# Altium schematic sheet Supply.SchDoc
size A4
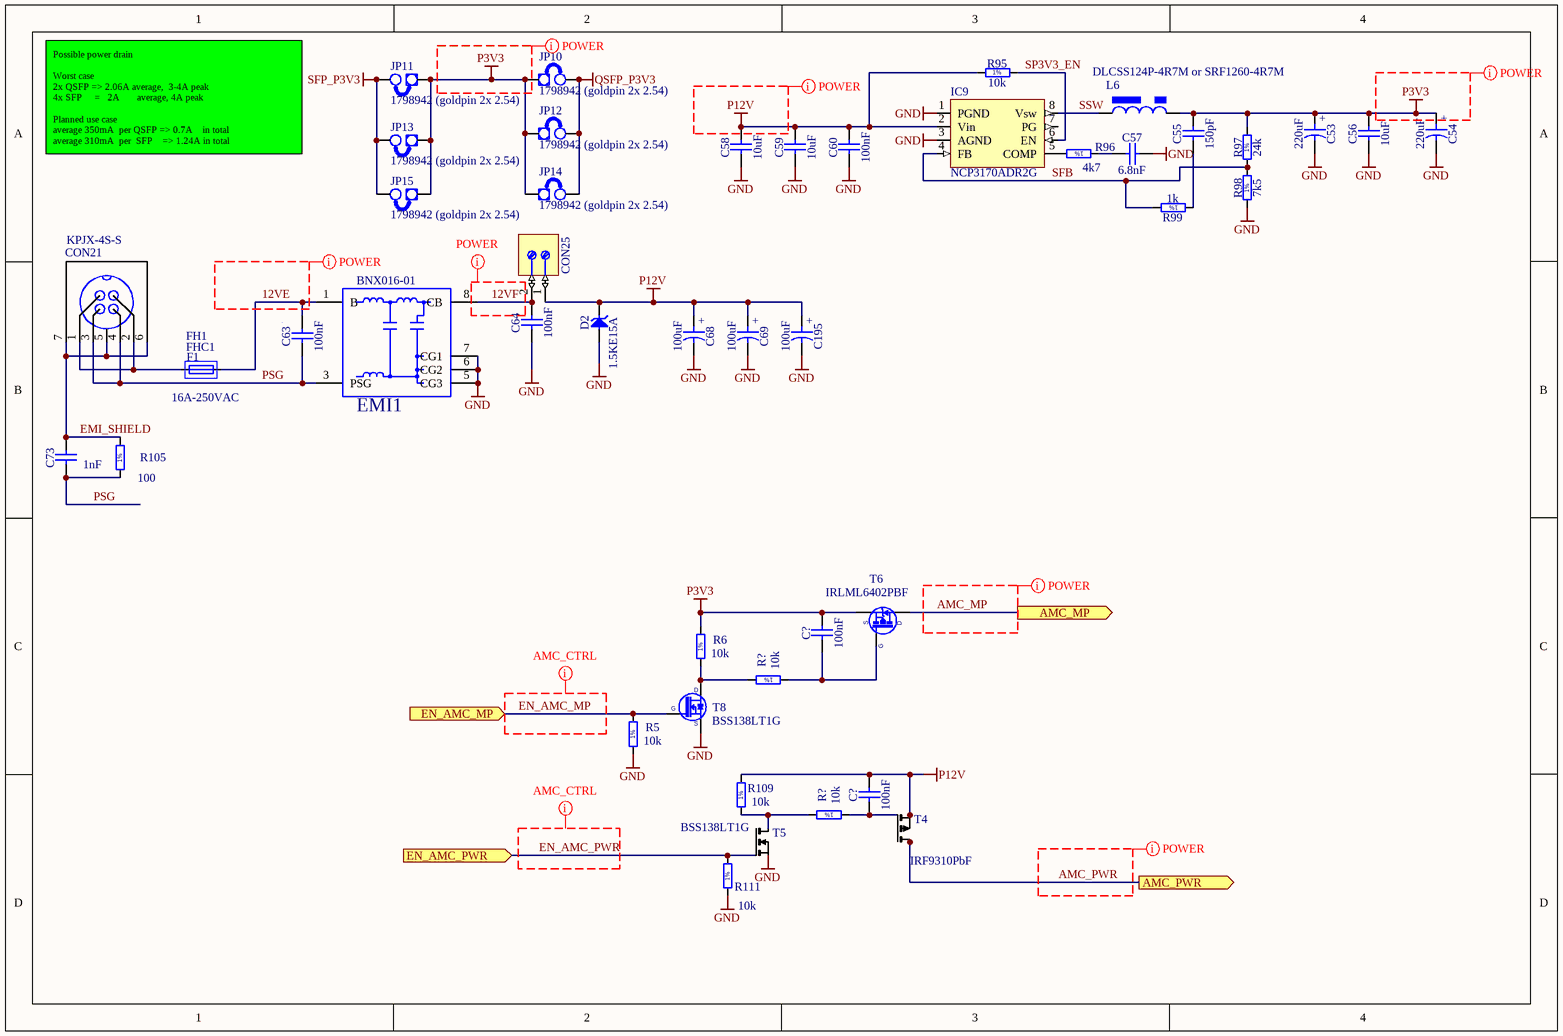
[diagram p0: Supply.SchDoc]

## Parts
(Parts that share a designator on the sheet are numbered #1, #2 ... from top to bottom, then left to right.)
C53  220uF  [CAPMP7343X310N]
C54  220uF  [CAPMP7343X310N]
C55  150pF  [CAPC1608X87N]
C56  10uF  [CAPC2012X135N]
C57  6.8nF  [CAPC1608X87N]
C58  10uF  [CAPC3216X140N]
C59  10uF  [CAPC3216X140N]
C60  100nF  [CAPC1005X55N]
C63  100nF  [CAPC1005X55N]
C64  100nF  [CAPC1005X55N]
C68  100uF  [CAPMP7343X430N]
C69  100uF  [CAPMP7343X430N]
C73  1nF  [CAPC3216X140N]
C195  100uF  [CAPMP7343X430N]
C?#1  100nF  [CAPC1005X55N]
C?#2  100nF  [CAPC1005X55N]
CON21  KPJX-4S-S  [CON_KPJX-4S-S]
CON25  (no value)  [PHOENIX_1715721]
D2  1.5KE15A  [VISHAY_1.5KE]
EMI1  BNX016-01  [BNX016-01]
F1  16A-250VAC  [FUSE_5X20_GLASS_h]
FH1  Fuse Holder  [FUSH_SCHURTER_OGN]  (value not drawn)
FHC1  Fuse Holder Cover No Pin  [FUSHC_SCHURTER_0853.0551]  (value not drawn)
IC9  NCP3170ADR2G  [so-8]
JP10  1798942 (goldpin 2x 2.54)  [jump]
JP11  1798942 (goldpin 2x 2.54)  [jump]
JP12  1798942 (goldpin 2x 2.54)  [jump]
JP13  1798942 (goldpin 2x 2.54)  [jump]
JP14  1798942 (goldpin 2x 2.54)  [jump]
JP15  1798942 (goldpin 2x 2.54)  [jump]
L6  DLCSS124P-4R7M or SRF1260-4R7M  [choke_DLCSS124]
R5  10k  [RESC1005X40N]
R6  10k  [RESC1005X40N]
R95  10k  [RESC1005X40N]
R96  4k7  [RESC1005X40N]
R97  24k  [RESC1608X55N]
R98  7k5  [RESC1608X55N]
R99  1k  [RESC1005X40N]
R105  100  [RESC1005X40N]
R109  10k  [RESC1005X40N]
R111  10k  [RESC1005X40N]
R?#1  10k  [RESC1005X40N]
R?#2  10k  [RESC1005X40N]
T4  IRF9310PbF  [so-8]
T5  BSS138LT1G  [SOT95P251X112-3N]
T6  IRLML6402PBF  [SOT95P237X112-3N]
T8  BSS138LT1G  [SOT95P240X110-3N]

## Ports
AMC_MP (out), AMC_PWR (out), EN_AMC_MP (in), EN_AMC_PWR (in)

## Nets
GND: C53.2 C54.2 C56.1 C57.2 C58.1 C59.1 C60.1 C64.1 C68.2 C69.2 C195.2 D2.2(A) EMI1.5(CG3) EMI1.6(CG2) EMI1.7(CG1) IC9.1(PGND) IC9.3(AGND) R5.1 R98.1 R111.1 T5.2(S) T8.2(S)
P3V3: C53.1 C54.1 C55.2 C56.2 C?#1.2 JP10.1(E1) JP11.1(E1) JP12.1(E1) JP13.1(E1) JP14.1(E1) JP15.1(E1) L6.2 R6.2 R97.2 T6.2(S)
P12V: C58.2 C59.2 C60.2 C68.1 C69.1 C195.1 C?#2.2 CON25.1 D2.1(C) IC9.2(Vin) R95.1 R109.2 T4.1(S1) T4.2(S1) T4.3(S1)
QSFP_P3V3: JP10.2(E2) JP12.2(E2) JP14.2(E2)
SFP_P3V3: JP11.2(E2) JP13.2(E2) JP15.2(E2)
12VE: C63.2 EMI1.1(B) FH1.2
12VF: C64.2 CON25.2 EMI1.8(CB)
AMC_MP: T6.3(D) ; port AMC_MP
AMC_PWR: T4.5(D1) T4.6(D1) T4.7(D1) T4.8(D1) ; port AMC_PWR
EMI_SHIELD: C73.2 CON21.5 CON21.6 CON21.7 R105.2
EN_AMC_MP: R5.2 T8.1(G) ; port EN_AMC_MP
EN_AMC_PWR: R111.2 T5.1(G) ; port EN_AMC_PWR
PSG: C63.1 C73.1 CON21.3 CON21.4 EMI1.3(PSG) R105.1
SFB: IC9.4(FB) R97.1 R98.2 R99.2
SP3V3_EN: IC9.6(EN) R95.2
SSW: IC9.8(Vsw) L6.1
NetC55_1: C55.1 R99.1
NetC57_1: C57.1 R96.1
NetC?#1_1: C?#1.1 R?#1.1 T6.1(G)
NetC?#2_1: C?#2.1 R?#2.1 T4.4(G1)
NetCON21_1: CON21.1 CON21.2 FH1.1
NetIC9_5: IC9.5(COMP) R96.2
NetR6_1: R6.1 R?#1.2 T8.3(D)
NetR109_1: R109.1 R?#2.2 T5.3(D)

Not connected (* = marked no-connect by the designer): IC9 7(PG)

## Layout directives
net class POWER: 12VE, 12VF, AMC_MP, AMC_PWR, P3V3, P12V
net class AMC_CTRL: EN_AMC_MP, EN_AMC_PWR

## Notes on the sheet
- Possible power drain
  Worst case
  2x QSFP => 2.06A average,  3-4A peak
  4x SFP     =   2A       average, 4A peak
  Planned use case
  average 350mA  per QSFP => 0.7A    in total
  average 310mA  per  SFP    => 1.24A in total
- (in symbol CTE7343-31_220UF_6.3V_20%_LESR0009_KEMET_T520) +
- (in symbol CTE7343-43_100UF_20V_10%_LESR0150) +
- (in symbol R0402_1K_1%_0.0625W_100PPM) 1%
- (in symbol R0402_4K7_1%_0.0625W_100PPM) 1%
- (in symbol R0402_10K_1%_0.0625W_100PPM) 1%
- (in symbol R0402_100R_1%_0.0625W_100PPM) 1%
- (in symbol R0603_7K5_1%_0.1W_100PPM) 1%
- (in symbol R0603_24K_1%_0.1W_100PPM) 1%

## Library data of the parts
C53 C54 = CTE7343-31_220UF_6.3V_20%_LESR0009_KEMET_T520: Polarised capacitor; Part Description: Low ESR 0R009 Tantalum Chip Capacitor; Manufacturer: KEMET; Manufacturer Part Number: T520D227M006ATE009; Voltage: 6.3V; Tolerance: ±20%; Part Number: CTE7343-31_220UF_6.3V_20%_LESR0009_KEMET_T520; Component Kind: Standard; Component Type: Standard; Pin Count: 2; Value: 220uF; Status: Preferred; Case: D; Mounted: Yes; Socket: No; SMD: Yes; Sense: No; ComponentHeight: 3.1mm; HelpURL: \\cern.ch\dfs\Applications\Altium\Datasheets\CTE-LESR_KEMET_T520.pdf; Author: CERN DEM JLC; CreateDate: 10/25/2012; LatestRevisionDate: 10/25/2012
C55 = CC0603_150PF_50V_5%_NP0: Non-polarised capacitor; Part Description: SMD Multilayer Chip Ceramic Capacitor; Manufacturer: GENERIC; Manufacturer1 Part Number: 223886715151; Voltage: 50V; TC: NP0; Tolerance: ±5%; Table: Capacitors SMD; Part Number: CC0603_150PF_50V_5%_NP0; Component Kind: Standard; Component Type: Standard; Pin Count: 2; Value: 150pF; Status: Preferred; Manufacturer Part Number: CC0603_150PF_50V_5%_NP0; Case: 0603; Mounted: Yes; Socket: No; SMD: Yes; Manufacturer1 Example: PHYCOMP; Manufacturer1 ComponentHeight: 0.87mm; HelpURL: \\cern.ch\dfs\Applications\Altium\Datasheets\CC0603_NP0_PHYCOMP.pdf; Author: CERN DEM JLC; CreateDate: 2007-12-03; LatestRevisionDate: 2007-12-03
C56 = CC0805_10UF_10V_10%_X7R: Non-polarised capacitor; Part Description: SMD Multilayer Chip Ceramic Capacitor; Manufacturer: GENERIC; Manufacturer1 Part Number: GRM21BR71A106KE51L; Voltage: 10V; TC: X7R; Tolerance: ±10%; Table: Capacitors SMD; Part Number: CC0805_10UF_10V_10%_X7R; Component Kind: Standard; Component Type: Standard; Pin Count: 2; Value: 10uF; Status: Preferred; Manufacturer Part Number: CC0805_10UF_10V_10%_X7R; Case: 0805; Mounted: Yes; Socket: No; SMD: Yes; Manufacturer1 Example: MURATA; Manufacturer1 ComponentHeight: 1.35mm; HelpURL: \\cern.ch\dfs\Applications\Altium\Datasheets\CC0805_X7R_MURATA.pdf; Author: CERN DEM JLC; CreateDate: 2012-04-30; LatestRevisionDate: 2012-04-30
C57 = CC0603_6.8NF_50V_5%_C0G: Non-polarised capacitor; Part Description: SMD Multilayer Chip Ceramic Capacitor; Manufacturer: GENERIC; Manufacturer1 Part Number: C0603C682J5GACTU; Voltage: 50V; TC: C0G; Tolerance: ±5%; Table: Capacitors SMD; Part Number: CC0603_6.8NF_50V_5%_C0G; Component Kind: Standard; Component Type: Standard; Pin Count: 2; Value: 6.8nF; Status: Preferred; Manufacturer Part Number: CC0603_6.8NF_50V_5%_C0G; Case: 0603; Mounted: Yes; Socket: No; SMD: Yes; Manufacturer1 Example: KEMET; Manufacturer1 ComponentHeight: 0.87mm; HelpURL: \\cern.ch\dfs\Applications\Altium\Datasheets\CC0603_C0G_KEMET.pdf; Author: CERN DEM JLC; CreateDate: 2013-10-01; LatestRevisionDate: 2013-10-01
C58 C59 = CC1206_10UF_16V_10%_X7R: Non-polarised capacitor; Part Description: SMD Multilayer Chip Ceramic Capacitor; Manufacturer: GENERIC; Manufacturer1 Part Number: C1206C106K4RAC; Voltage: 16V; TC: X7R; Tolerance: ±10%; Table: Capacitors SMD; Part Number: CC1206_10UF_16V_10%_X7R; Component Kind: Standard; Component Type: Standard; Pin Count: 2; Value: 10uF; Status: Preferred; Manufacturer Part Number: CC1206_10uF_16V_10%_X7R; Case: 1206; Mounted: Yes; Socket: No; SMD: Yes; Manufacturer1 Example: KEMET; Manufacturer1 ComponentHeight: 1.8mm; HelpURL: \\cern.ch\dfs\Applications\Altium\Datasheets\CC1206_X7R_KEMET.pdf; Author: CERN DEM JLC; CreateDate: 2009-04-28; LatestRevisionDate: 2009-04-28
C60 C63 C64 C?#1 C?#2 = CC0402_100NF_16V_10%_X5R: Non-polarised capacitor; Part Description: SMD Multilayer Chip Ceramic Capacitor; Manufacturer: GENERIC; Manufacturer1 Part Number: GRM155R61C104KA88D; Voltage: 16V; TC: X5R; Tolerance: ±10%; Table: Capacitors SMD; Part Number: CC0402_100NF_16V_10%_X5R; Component Kind: Standard; Component Type: Standard; Pin Count: 2; Value: 100nF; Status: None; Manufacturer Part Number: CC0402_100NF_16V_10%_X5R; Case: 0402; Mounted: Yes; Socket: No; SMD: Yes; Manufacturer1 Example: MURATA; Manufacturer1 ComponentHeight: 0.55mm; HelpURL: \\cern.ch\dfs\Applications\Altium\Datasheets\CC0402_X5R_MURATA_GRM.pdf; Author: CERN DEM JLC; CreateDate: 2013-12-10; LatestRevisionDate: 2013-12-10
C68 C69 C195 = CTE7343-43_100UF_20V_10%_LESR0150: Polarised capacitor; Part Description: Low ESR 0R15 Solid Tantalum Chip Capacitor; Manufacturer: GENERIC; Manufacturer1 Part Number: TPSE107K020R0150; Voltage: 20V; Tolerance: ±10%; Table: Capacitors SMD; Part Number: CTE7343-43_100UF_20V_10%_LESR0150; Component Kind: Standard; Component Type: Standard; Pin Count: 2; Value: 100uF; Status: Preferred; Manufacturer Part Number: CTE7343-43_100UF_20V_10%_LESR0150; Case: E; Mounted: Yes; Socket: No; SMD: Yes; Manufacturer1 Example: AVX; Manufacturer1 ComponentHeight: 4.3mm; HelpURL: \\cern.ch\dfs\Applications\Altium\Datasheets\CTE-LESR_AVX_TPS.pdf; Author: CERN DEM JLC; CreateDate: 2008-05-05; LatestRevisionDate: 2009-01-20
C73 = CC1206_1NF_100V_5%_NP0: Non-polarised capacitor; Part Description: SMD Multilayer Chip Ceramic Capacitor; Manufacturer: GENERIC; Manufacturer1 Part Number: 12061A102JAT2A; Voltage: 100V; TC: NP0; Tolerance: ±5%; Table: Capacitors SMD; Part Number: CC1206_1NF_100V_5%_NP0; Component Kind: Standard; Component Type: Standard; Pin Count: 2; Value: 1nF; Status: Preferred; Manufacturer Part Number: CC1206_1NF_100V_5%_NP0; Case: 1206; Mounted: Yes; Socket: No; SMD: Yes; Manufacturer1 Example: AVX; Manufacturer1 ComponentHeight: 0.94mm; HelpURL: \\cern.ch\dfs\Applications\Altium\Datasheets\CC1206_NP0_AVX.pdf; Author: CERN DEM JLC; CreateDate: 2011-04-06; LatestRevisionDate: 2011-04-06
CON21 = CON_DC_7.5A_4pin: 7.5A DC connector
CON25 = PHOENIX_1715721: Terminal Block, 2 Positions, Screw Connection; Part Description: 17.5A, 400V, Terminal Block, Pitch 5.08mm, 2 Positions, Screw Connection; Manufacturer: PHOENIX CONTACT; Manufacturer Part Number: 1715721 (MKDS 1,5/2-5,08); PressFit: No; Part Number: PHOENIX_1715721; Component Kind: Standard; Component Type: Standard; Pin Count: 2; Mounted: Yes; Socket: No; SMD: No; Sense: No; Status: None; ComponentHeight: 13.8mm; HelpURL: \\cern.ch\dfs\Applications\Altium\Datasheets\PHOENIX_1715721.pdf; Author: CERN DEM JLC; CreateDate: 1/6/2010; LatestRevisionDate: 2/25/2013
D2 = 1.5KE15A: Transient Voltage Suppressor Diode (Uni-Directional); Part Description: Uni-directional  Transient Voltage Suppressor Diode - TRANSZORB®; Manufacturer: VISHAY GENERAL SEMICONDUCTOR; Voltage: 15V; Power: 1500W; Table: Diodes; Part Number: 1.5KE15A; Component Kind: Standard; Component Type: Standard; Device: 1.5KE15A; PackageDescription: VISHAY 1.5KE Case Style, Diode, Axial; Lead Spacing 20.32mm, Lead Dia. 1.07mm, Body Length 9.5mm, Body Dia. 5.3mm; Manufacturer Part Number: 1.5KE15A; Pin Count: 2; Mounted: Yes; Socket: No; SMD: No; ComponentHeight: 5.3mm; HelpURL: \\cern.ch\dfs\Applications\Altium\Datasheets\1.5KE.pdf; Author: CERN DEM JLC; CreateDate: 2012-12-11; LatestRevisionDate: 2012-12-11
EMI1 = L_CMC_BNX016-01.1: FILTER EMI 50MOHM 15A .1M-1GHZ; PART_TYPE: COMBINED; DXDB_LIBNAME: FILTERS; OWNER: 3709; DIST_P/N: 490-5055-ND; DIST: DIGIKEY; MANF: MURATA; DEVICE: BNX016-01; PKG_TYPE: BNX016-01; MANF_P/N: BNX016-01; DATASHEET: \\XSJ-SMB\AFX\AFX\BOARD_PROJECTS\LIBRARY\\DATASHEETS\FILTER\L0117BNX01.PDF; ROHS: YES; CURRENT: 15A; VALUE: 50MOHM
F1 = FUSE_SCHURTER_0034.3129_h: Fuse; Part Description: Cylindrical 5x20 mm, Time-Lag T Miniature Fuse, FST Serie; Table: Fuses; Part Number: FUSE_SCHURTER_0034.3129_h; Component Kind: Standard; Component Type: Standard; Pin Count: 0; PackageDescription: 5x20mm Cylindrical Fuse, SCHURTER FST5X20 Serie; Family: Fuse; Mounted: Yes; Socket: Yes; SMD: No; Value: 16A-250VAC; Manufacturer: SCHURTER; Manufacturer Part Number: 0034.3129; ComponentHeight: 5.2mm; HelpURL: \\cern.ch\dfs\Applications\Altium\Datasheets\FUSE_SCHURTER_FST5X20.pdf; Author: CERN DEM JLC; CreateDate: 2013-01-28; LatestRevisionDate: 2013-01-28
FH1 = FUSH_SCHURTER-OGN_0031.8211: Part Description: Fuse holder for 5x20mm Fuses; Table: Fuses; Part Number: FUSH_SCHURTER-OGN_0031.8211; Component Kind: Standard; Component Type: Standard; Pin Count: 2; PackageDescription: SCHURTER OGN Series, Fuse holder for 5x20mm Fuses; Family: Fuse Holder; Mounted: Yes; Socket: No; SMD: No; Manufacturer: SCHURTER; Manufacturer Part Number: 0031.8211; ComponentHeight: 11.5mm; HelpURL: \\cern.ch\dfs\Applications\Altium\Datasheets\FUSH_SCHURTER_OGN.pdf; Author: CERN DEM JLC; CreateDate: 2008-06-03; LatestRevisionDate: 2008-07-02
FHC1 = FUSHC_SCHURTER_0853.0551: Part Description: Cover for Fuse Holder OGN, OGN-SMD; Table: Fuses; Part Number: FUSHC_SCHURTER_0853.0551; Component Kind: Standard; Component Type: Standard; Pin Count: 0; PackageDescription: Cover for Fuse Holder OGN, OGN-SMD; Family: Fuse Holder Cover; Mounted: Yes; Socket: No; SMD: No; Manufacturer: SCHURTER; Manufacturer Part Number: 0853.0551; ComponentHeight: 12.5mm; HelpURL: \\cern.ch\dfs\Applications\Altium\Datasheets\FUSHC_SCHURTER_0853.0551.pdf; Author: CERN DEM JLC; CreateDate: 2013-03-06; LatestRevisionDate: 2013-03-06
IC9 = PWM_NCP3170: 4.5V to 18V, 3A synch buck
JP10-JP15 = JUMPER: Supplier 1: Farnell; Supplier Part Number 1: 1798942
L6 = L_POWER_CSS124_6.8uH: Shielded Ferrite base SMD Power Choke DLCSS124P Series 4.7uH, 20%, 5.7A, 0.018R, 750pcs/reel; Supplier 1: Newark; Supplier Part Number 1: 14T0949
R5 R6 R95 R109 R111 R?#1 R?#2 = R0402_10K_1%_0.0625W_100PPM: Resistor - 1%; Part Description: General Purpose Thick Film Chip Resistor; Manufacturer: GENERIC; Manufacturer1 Part Number: 232270671003L; TC: ±100ppm/°C; Table: Resistors SMD; Part Number: R0402_10K_1%_0.0625W_100PPM; Component Kind: Standard; Component Type: Standard; Pin Count: 2; Value: 10k; Status: Not recommended; Power: 0.0625W; Tolerance: ±1%; Manufacturer Part Number: R0402_10K_1%_0.0625W_100PPM; Case: 0402; Mounted: Yes; Socket: No; SMD: Yes; Manufacturer1 Example: YAGEO PHYCOMP; Manufacturer1 ComponentHeight: 0.4mm; HelpURL: \\cern.ch\dfs\Applications\Altium\Datasheets\R0402_Phycomp_RC0402.pdf; Author: CERN DEM JLC; CreateDate: 2007-12-03; LatestRevisionDate: 2012-10-17
R96 = R0402_4K7_1%_0.0625W_100PPM: Resistor - 1%; Part Description: General Purpose Thick Film Chip Resistor; Manufacturer: GENERIC; Manufacturer1 Part Number: 232270674702L; TC: ±100ppm/°C; Table: Resistors SMD; Part Number: R0402_4K7_1%_0.0625W_100PPM; Component Kind: Standard; Component Type: Standard; Pin Count: 2; Value: 4k7; Status: Not recommended; Power: 0.0625W; Tolerance: ±1%; Manufacturer Part Number: R0402_4K7_1%_0.0625W_100PPM; Case: 0402; Mounted: Yes; Socket: No; SMD: Yes; Manufacturer1 Example: YAGEO PHYCOMP; Manufacturer1 ComponentHeight: 0.4mm; HelpURL: \\cern.ch\dfs\Applications\Altium\Datasheets\R0402_Phycomp_RC0402.pdf; Author: CERN DEM JLC; CreateDate: 2007-12-03; LatestRevisionDate: 2012-10-17
R97 = R0603_24K_1%_0.1W_100PPM: Resistor - 1%; Part Description: General Purpose Thick Film Chip Resistor; Manufacturer: GENERIC; Manufacturer1 Part Number: NRC06F2402TRF; Power: 0.1W; TC: ±100ppm/°C; Table: Resistors SMD; Part Number: R0603_24K_1%_0.1W_100PPM; Component Kind: Standard; Component Type: Standard; Pin Count: 2; Value: 24k; Status: Preferred; Tolerance: ±1%; Manufacturer Part Number: R0603_24K_1%_0.1W_100PPM; Case: 0603; Mounted: Yes; Socket: No; SMD: Yes; Manufacturer1 Example: NIC COMPONENT; Manufacturer1 ComponentHeight: 0.55mm; HelpURL: \\cern.ch\dfs\Applications\Altium\Datasheets\R0603_NIC_NRC.pdf; Author: CERN DEM JLC; CreateDate: 2007-12-03; LatestRevisionDate: 2008-03-13
R98 = R0603_7K5_1%_0.1W_100PPM: Resistor - 1%; Part Description: General Purpose Thick Film Chip Resistor; Manufacturer: GENERIC; Manufacturer1 Part Number: NRC06F7501TRF; Power: 0.1W; TC: ±100ppm/°C; Table: Resistors SMD; Part Number: R0603_7K5_1%_0.1W_100PPM; Component Kind: Standard; Component Type: Standard; Pin Count: 2; Value: 7k5; Status: Preferred; Tolerance: ±1%; Manufacturer Part Number: R0603_7K5_1%_0.1W_100PPM; Case: 0603; Mounted: Yes; Socket: No; SMD: Yes; Manufacturer1 Example: NIC COMPONENT; Manufacturer1 ComponentHeight: 0.55mm; HelpURL: \\cern.ch\dfs\Applications\Altium\Datasheets\R0603_NIC_NRC.pdf; Author: CERN DEM JLC; CreateDate: 2007-12-03; LatestRevisionDate: 2008-03-13
R99 = R0402_1K_1%_0.0625W_100PPM: Resistor - 1%; Part Description: General Purpose Thick Film Chip Resistor; Manufacturer: GENERIC; Manufacturer1 Part Number: 232270671002L; TC: ±100ppm/°C; Table: Resistors SMD; Part Number: R0402_1K_1%_0.0625W_100PPM; Component Kind: Standard; Component Type: Standard; Pin Count: 2; Value: 1k; Status: Not recommended; Power: 0.0625W; Tolerance: ±1%; Manufacturer Part Number: R0402_1K_1%_0.0625W_100PPM; Case: 0402; Mounted: Yes; Socket: No; SMD: Yes; Manufacturer1 Example: YAGEO PHYCOMP; Manufacturer1 ComponentHeight: 0.4mm; HelpURL: \\cern.ch\dfs\Applications\Altium\Datasheets\R0402_Phycomp_RC0402.pdf; Author: CERN DEM JLC; CreateDate: 2007-12-03; LatestRevisionDate: 2012-10-17
R105 = R0402_100R_1%_0.0625W_100PPM: Resistor - 1%; Part Description: General Purpose Thick Film Chip Resistor; Manufacturer: GENERIC; Manufacturer1 Part Number: 232270671001L; TC: ±100ppm/°C; Table: Resistors SMD; Part Number: R0402_100R_1%_0.0625W_100PPM; Component Kind: Standard; Component Type: Standard; Pin Count: 2; Value: 100; Status: Not recommended; Power: 0.0625W; Tolerance: ±1%; Manufacturer Part Number: R0402_100R_1%_0.0625W_100PPM; Case: 0402; Mounted: Yes; Socket: No; SMD: Yes; Manufacturer1 Example: YAGEO PHYCOMP; Manufacturer1 ComponentHeight: 0.4mm; HelpURL: \\cern.ch\dfs\Applications\Altium\Datasheets\R0402_Phycomp_RC0402.pdf; Author: CERN DEM JLC; CreateDate: 2007-12-03; LatestRevisionDate: 2012-10-17
T4 = Q_IRF9310: PMOS 30V, 4.6mR, 20A, 2.5W
T5 = Q_BSS138
T6 = IRLML6402PBF: P-CHANNEL MOSFET WITH ZENER DIODE; Part Description: -20V -3.7A P-Channel HEXFET® Power MOSFET; Manufacturer: INTERNATIONAL RECTIFIER; PressFit: No; Bonding: No; Part Number: IRLML6402PBF; Component Kind: Standard; Component Type: Standard; Device: IRLML6402PBF; PackageDescription: SOT, 0.95mm, pitch; 3 pin,1.30mm W X 2.92mm L X 1.12mm H body, IPC Medium Density; Manufacturer Part Number: IRLML6402PBF; Pin Count: 3; Case: SOT23-3; Mounted: Yes; Socket: No; SMD: Yes; Sense: No; ComponentHeight: 1.12mm; HelpURL: \\cern.ch\dfs\Applications\Altium\Datasheets\IRLML6402PBF.pdf; Author: CERN DEM JLC; CreateDate: 8/29/2011; LatestRevisionDate: 8/29/2011
T8 = BSS138LT1G: N-CHANNEL MOSFET WITH DIODE; Part Description: 50V 200mA N-Channel Enhancement Mode Field-Effect Transistor; Manufacturer: ON SEMICONDUCTOR; PressFit: No; Bonding: No; Part Number: BSS138LT1G; Component Kind: Standard; Component Type: Standard; Device: BSS138LT1G; PackageDescription: SOT23 3-Leads, Pitch 0.95mm - Body 1.4x3mm, IPC Medium Density; Manufacturer Part Number: BSS138LT1G; Pin Count: 3; Case: SOT23-3; Mounted: Yes; Socket: No; SMD: Yes; Sense: No; ComponentHeight: 1.11mm; HelpURL: \\cern.ch\dfs\Applications\Altium\Datasheets\BSS138LT1G.pdf; Author: CERN DEM JLC; CreateDate: 3/23/2009; LatestRevisionDate: 3/23/2009